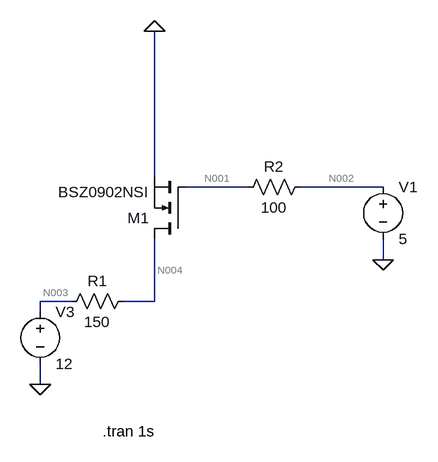
[diagram p0: schematic Draft1.asc]
Draft1.asc, the LTspice schematic file:
Version 4.1
SHEET 1 880 680
WIRE -400 128 -400 -96
WIRE -256 144 -352 144
WIRE -48 144 -176 144
WIRE -48 256 -48 224
WIRE -528 320 -576 320
WIRE -400 320 -400 224
WIRE -400 320 -448 320
WIRE -576 336 -576 320
WIRE -576 448 -576 416
FLAG -48 256 0
FLAG -400 -96 0
FLAG -576 448 0
DATAFLAG -400 96 ""
SYMBOL voltage -48 128 R0
WINDOW 123 0 0 Left 0
WINDOW 39 0 0 Left 0
SYMATTR InstName V1
SYMATTR Value 5
SYMBOL nmos -352 224 R180
SYMATTR InstName M1
SYMATTR Value BSZ0902NSI
SYMBOL res -160 128 R90
WINDOW 0 0 56 VBottom 2
WINDOW 3 32 56 VTop 2
SYMATTR InstName R2
SYMATTR Value 100
SYMBOL res -432 304 R90
WINDOW 0 0 56 VBottom 2
WINDOW 3 32 56 VTop 2
SYMATTR InstName R1
SYMATTR Value 150
SYMBOL voltage -576 320 R0
WINDOW 123 0 0 Left 0
WINDOW 39 0 0 Left 0
SYMATTR InstName V3
SYMATTR Value 12
TEXT -480 520 Left 2 !.tran 1s

The netlist it stands for:
* Draft1.asc
V1 N002 0 5
M1 N004 N001 0 0 BSZ0902NSI
R2 N002 N001 100
R1 N004 N003 150
V3 N003 0 12
.model NMOS NMOS
.model PMOS PMOS
.lib standard.mos
.tran 1s
.backanno
.end

* Results of the author's LTspice run, read from the files saved beside the schematic
* Operating Point, zero values left out:
*   V(n004) = 248.4 µV
*   V(n003) = 12 V
*   V(n002) = 5 V
*   V(n001) = 5 V
*   I(V3) = -80 mA
*   Id(M1) = 80 mA
*   Is(M1) = -80 mA
*   I(R1) = -80 mA